# EAGLE design jtag_interface (EAGLE 7.1.0)
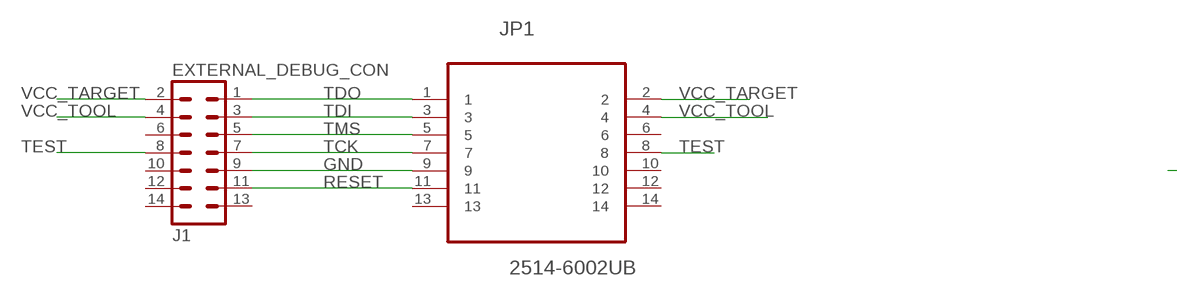
[diagram p0: schematic, sheet 1]

## Parts
J1  EXTERNAL_DEBUG_CON  [EXTERNAL_DEBUG]
JP1  2514-6002UB  [3M_2514-6002UB]

## Nets
GND: J1.9 JP1.9
RESET: J1.11 JP1.11
TCK: J1.7 JP1.7
TDI: J1.3 JP1.3
TDO: J1.1 JP1.1
TEST: J1.8 JP1.8
TMS: J1.5 JP1.5
VCC_TARGET: J1.2 JP1.2
VCC_TOOL: J1.4 JP1.4
Unconnected: J1.6 J1.10 J1.12 J1.13 J1.14 JP1.6 JP1.10 JP1.12 JP1.13 JP1.14

## Library data of the parts
J1 = jtag_interface:EXTERNAL_DEBUG_CON
JP1 = msp_jtag:2514-6002UB: Four-Wall Header; MPN: 2514-6002UB; OC_FARNELL: 1368928; OC_NEWARK: 46F4726; PACKAGE: Four-Wall Header, 14way; SUPPLIER: 3M

## Net classes
0 default: width 0.254 mm

## Board
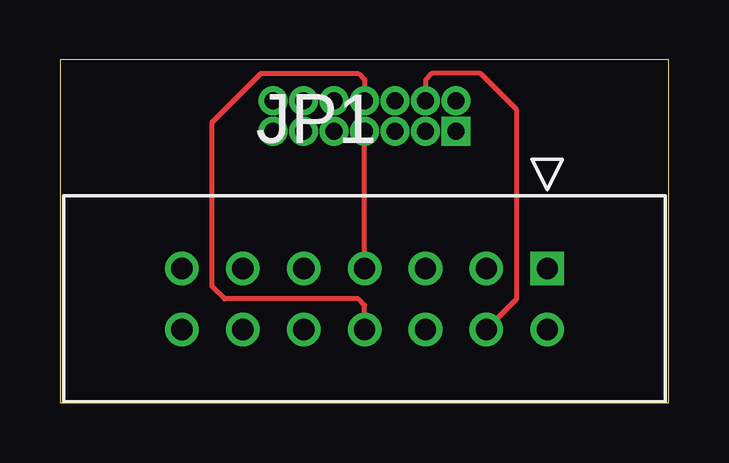
[diagram p1: board, top side]
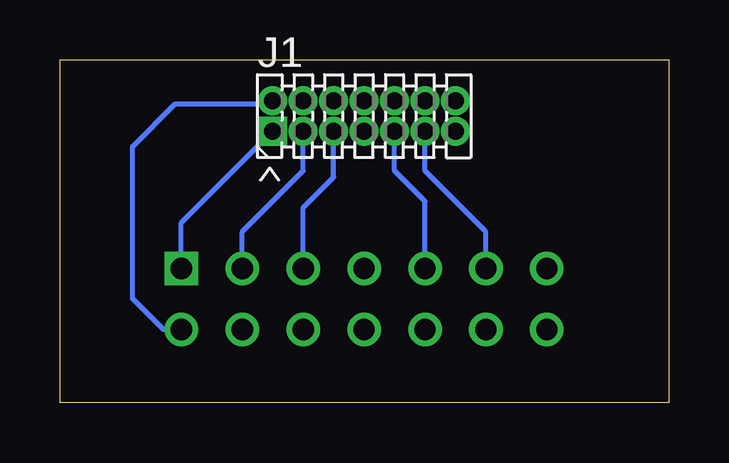
[diagram p2: board, bottom side, seen from below]

Size 25.38 x 14.28 mm. Coordinates in mm from the lower left corner, seen from the top.
Outline: 0,0 25.38,0 25.38,14.28 0,14.28 0,0
Copper layers (1*16): Top 0.035mm / dielectric 1.5mm / Bottom 0.035mm
Design rules "default": minimum track width 10mil, minimum drill 24mil, track to track 8mil, track to pad 8mil, pad to pad 8mil, via to via 8mil, smd to smd 8mil, copper to edge 40mil, drill to drill 8mil, minimum pad ring 10mil, minimum via ring 8mil, stop-mask expansion 4mil, vias tented up to drill 0mil, thermal gap 10mil

### Footprints (pad centres in the part's own frame; a part is rotated, then mirrored left to right if it is on the bottom)
EXTERNAL_DEBUG = drill 0.7 pad 0.93 square: 1 -2.54,-0.635 | drill 0.7 pad 0.93: 2 -2.54,0.635; 3 -1.27,-0.635; 4 -1.27,0.635; 5 0,-0.635; 6 0,0.635; 7 1.27,-0.635; 8 1.27,0.635; 9 2.54,-0.635; 10 2.54,0.635; 11 3.81,-0.635; 12 3.81,0.635; 13 5.08,-0.635; 14 5.08,0.635
3M_2514-6002UB = drill 0.889 square: 1 0,2.54 | drill 0.889: 2 0,0; 3 -2.54,2.54; 4 -2.54,0; 5 -5.08,2.54; 6 -5.08,0; 7 -7.62,2.54; 8 -7.62,0; 9 -10.16,2.54; 10 -10.16,0; 11 -12.7,2.54; 12 -12.7,0; 13 -15.24,2.54; 14 -15.24,0

### Placement (x,y rotation side)
J1  13.97,11.94 0 bottom
JP1  20.32,3.05 0 top

### Tracks (layer width: path | path; a pad name or v marks a point on that pad's centre or on a via)
GND
  Bottom 0.203: JP1.9 10.16,8.38 11.43,9.65 J1.9
RESET
  Bottom 0.203: JP1.11 7.62,7.11 10.16,9.65 J1.11
TCK
  Top 0.203: JP1.7 J1.7
TDI
  Bottom 0.203: JP1.3 17.78,7.11 15.24,9.65 J1.3
TDO
  Bottom 0.203: JP1.1 20.32,7.49 J1.1
TEST
  Top 0.203: JP1.8 12.7,4.06 12.45,4.32 6.86,4.32 6.35,4.83 6.35,11.68 8.38,13.72 12.45,13.72 12.7,13.46 J1.8
TMS
  Bottom 0.203: JP1.5 15.24,8.13 13.97,9.4 J1.5
VCC_TARGET
  Bottom 0.203: JP1.2 21.08,3.05 22.35,4.32 22.35,10.67 20.57,12.45 16.64,12.45 J1.2
VCC_TOOL
  Top 0.203: JP1.4 19.05,4.32 19.05,12.19 17.53,13.72 15.49,13.72 15.24,13.46 J1.4